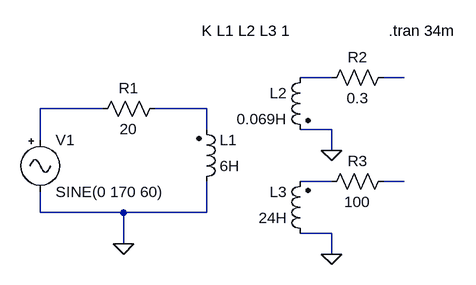
[diagram p0: schematic Draft19.asc]
Draft19.asc, the LTspice schematic file:
Version 4
SHEET 1 880 680
WIRE 464 176 416 176
WIRE 576 176 544 176
WIRE 112 224 16 224
WIRE 272 224 192 224
WIRE 272 256 272 224
WIRE 464 256 416 256
WIRE 16 272 16 224
WIRE 464 288 464 256
WIRE 464 336 416 336
WIRE 576 336 544 336
WIRE 16 384 16 352
WIRE 144 384 16 384
WIRE 272 384 272 336
WIRE 272 384 144 384
WIRE 464 416 416 416
WIRE 144 432 144 384
WIRE 464 448 464 416
FLAG 464 448 0
FLAG 464 288 0
FLAG 144 432 0
SYMBOL ind2 256 352 M180
WINDOW 0 36 80 Left 2
WINDOW 3 36 40 Left 2
SYMATTR InstName L1
SYMATTR Value 6H
SYMATTR Type ind
SYMBOL ind2 432 160 M0
SYMATTR InstName L2
SYMATTR Value 0.069H
SYMATTR Type ind
SYMBOL ind2 432 432 R180
WINDOW 0 36 80 Left 2
WINDOW 3 36 40 Left 2
SYMATTR InstName L3
SYMATTR Value 24H
SYMATTR Type ind
SYMBOL Misc/signal 16 256 R0
SYMATTR InstName V1
SYMATTR Value SINE(0 170 60)
SYMBOL res 208 208 R90
WINDOW 0 0 56 VBottom 2
WINDOW 3 32 56 VTop 2
SYMATTR InstName R1
SYMATTR Value 20
SYMBOL res 560 160 R90
WINDOW 0 0 56 VBottom 2
WINDOW 3 32 56 VTop 2
SYMATTR InstName R2
SYMATTR Value 0.3
SYMBOL res 560 320 R90
WINDOW 0 0 56 VBottom 2
WINDOW 3 32 56 VTop 2
SYMATTR InstName R3
SYMATTR Value 100
TEXT 264 104 Left 2 !K L1 L2 L3 1
TEXT 552 104 Left 2 !.tran 34m

The netlist it stands for:
* Draft19.asc
L1 0 N004 6H
L2 N001 0 0.069H
L3 0 N005 24H
V1 N003 0 SINE(0 170 60)
R1 N004 N003 20
R2 N002 N001 0.3
R3 N006 N005 100
K L1 L2 L3 1
.tran 34m
.backanno
.end